# Altium schematic sheet Sensors.SchDoc
size A4; SheetNumber: 2; SheetTotal: 4
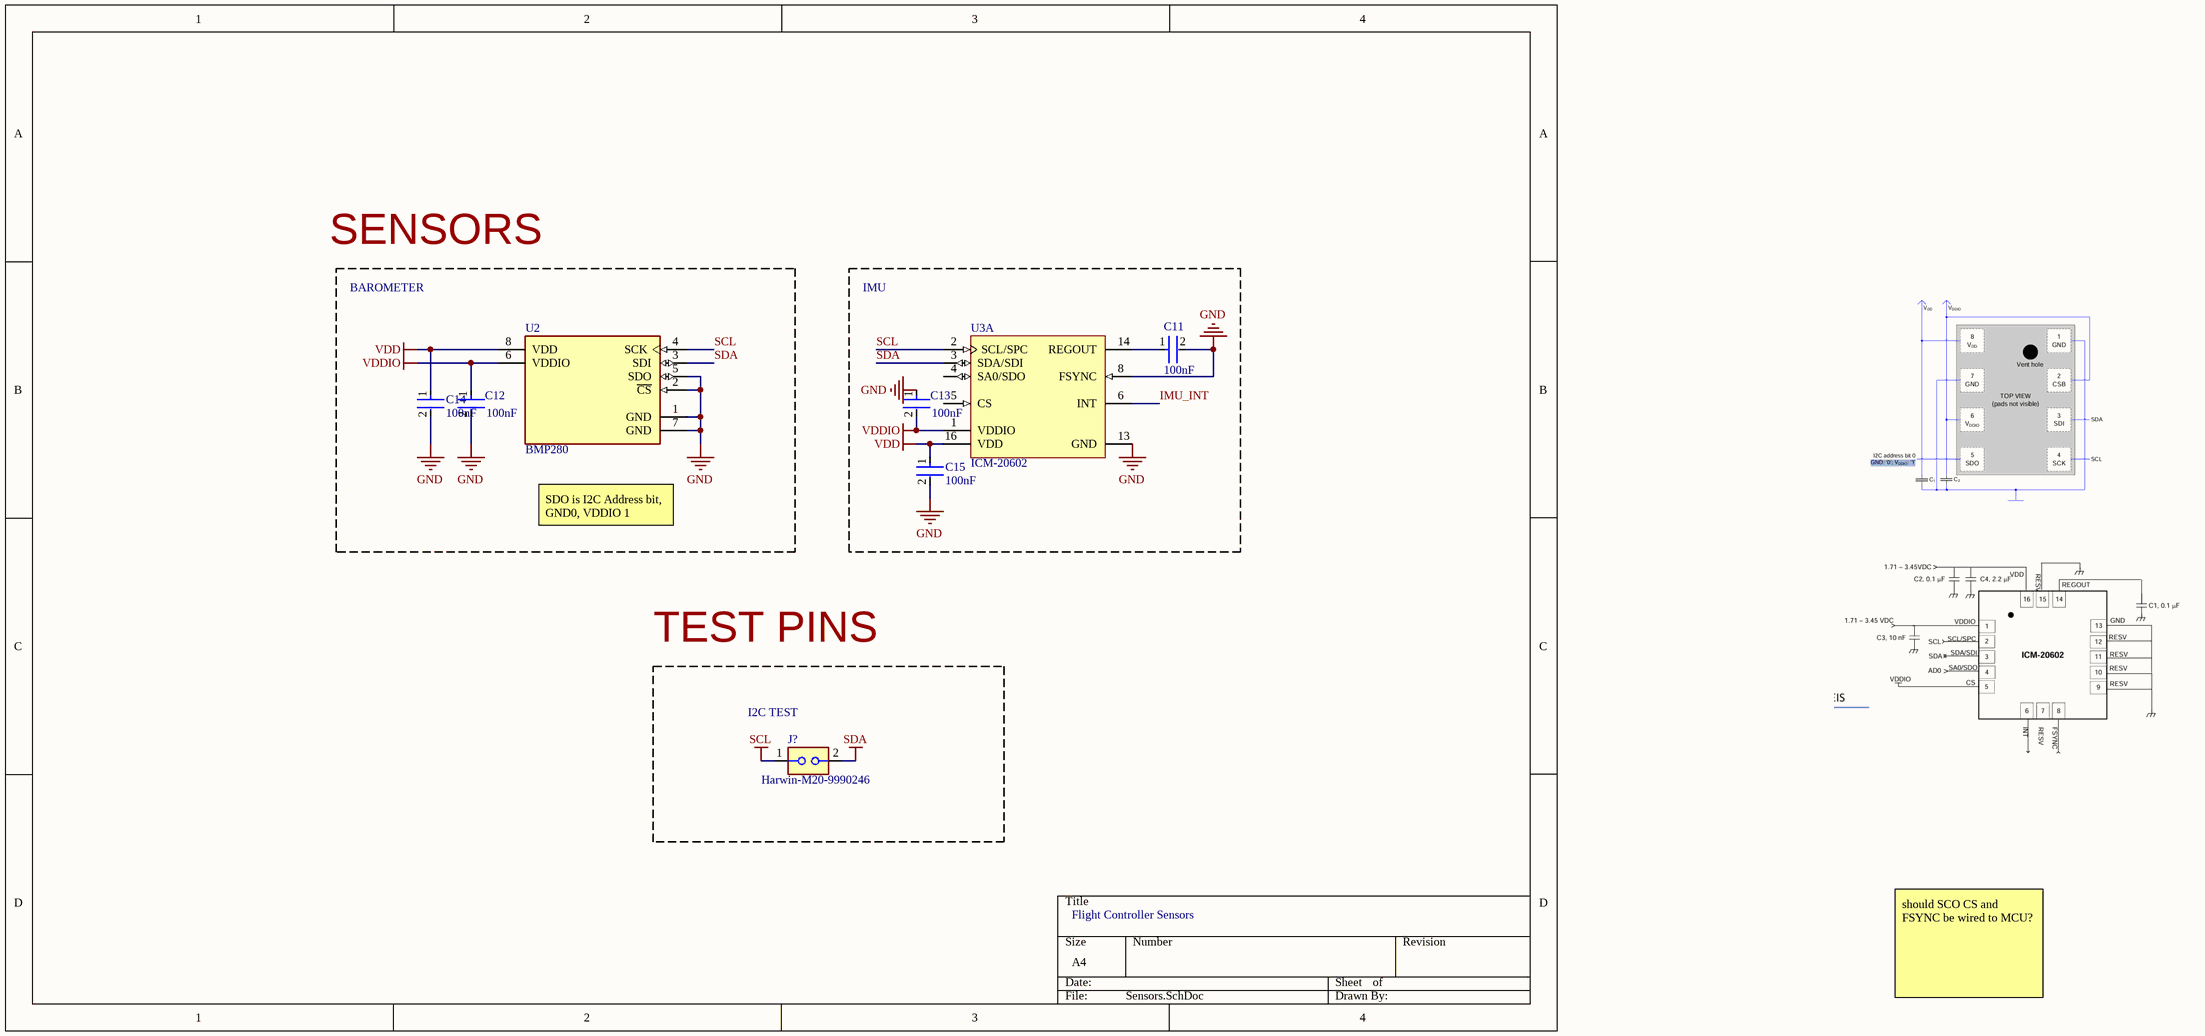
[diagram p0: Sensors.SchDoc]

## Parts
C11  100nF  [FP-CL93-IPC_C]
C12  100nF  [FP-CL93-IPC_C]
C13  100nF  [FP-CL93-IPC_C]
C14  100nF  [FP-CL93-IPC_C]
C15  100nF  [FP-CL93-IPC_C]
J?  Harwin-M20-9990246  [HARWIN_M20-9990246]
U2  BMP280  [FP-BMP280-MFG]
U3  ICM-20602  [INSE-I62-16]  (part A of 2)

## Blocks framed on the sheet
BAROMETER: C12 C14 U2
IMU: C11 C13 C15 U3
TEST PINS: J?

## Nets
GND: C11.2 C12.2 C13.1 C14.2 C15.2 U2.1(GND) U2.2(~{CS}) U2.5(SDO) U2.7(GND) U3.8(FSYNC) U3.13(GND)
SCL: J?.1 U2.4(SCK) U3.2(SCL/SPC)
SDA: J?.2 U2.3(SDI) U3.3(SDA/SDI)
VDD: C14.1 C15.1 U2.8(VDD) U3.16(VDD)
VDDIO: C12.1 C13.2 U2.6(VDDIO) U3.1(VDDIO)
IMU_INT: U3.6(INT)
NetC11_1: C11.1 U3.14(REGOUT)

Not connected (* = marked no-connect by the designer): U3 4(SA0/SDO) 5(CS)

## Notes on the sheet
- SENSORS
- SDO is I2C Address bit, GND0, VDDIO 1
- (near J?) I2C TEST
- Flight Controller Sensors
- should SCO CS and FSYNC be wired to MCU?

## Library data of the parts
C11-C15 = CMP-13271-000610-1: Cap Ceramic 100nF 10V X7R ±10% SMD 0402 +125°C Paper T/R
J? = CMP-00000-10: Connector Header Through Hole 2 position 0.100" (2.54mm); Number of Positions: 2; Contact Resistance: 30mR; Voltage Rating (AC): 750V; Max Current Rating: 3A; Insulation Resistance: 10GR; Gender: Male; Case/Package: SIL; Termination: Solder; Mount: Through Hole; Housing Material: Nylon; Max Operating Temperature: 105°C; JLCPCB Part No.: C3332353; Orientation: Straight; Contact Material: Bronze,Brass; Depth: 2.54mm; Current Rating: 3A; Radiation Hardening: No; Pitch: 2.54mm; Reach SVHC Compliant: No; Length: 5.08mm; Number of Rows: 1; Series: M20; Packaging: Bulk; Contact Plating: Tin; Contact Type: Male Pin; Color: Black; Contact Mating Length: 0.24inch; Package Quantity: 1000; Housing Color: Black; Min Operating Temperature: -40°C; Number of Contacts: 2
U2 = CMP-2000-05076-3: SENSOR PRESSURE ABS; Operating Pressure: 15.95PSI; Pressure Type: Absolute; Output Type: SPI; Max Pressure: 290.08PSI; Port Style: No Port; Case/Package: SMD/SMT; Lead Free: Lead Free; Termination: SMD/SMT; Min Operating Temperature: -40°C; Number of Pins: 8; Max Operating Temperature: 85°C
U3 = CMP-2000-07589-1: High Performance 6-Axis MEMS MotionTracking(TM) Device, 1.71 to 3.45 V, -40 to 85 degC, 16-Pin LGA, RoHS; Manufacturer: InvenSense; Sensor Type: Temperature; Output Type: I2C; RoHSCompliant: True; Datasheet Version: Rev. 1.0, 10/2016; Datasheet URL: http://www.invensense.com/wp-content/uploads/2016/10/DS-000176-ICM-20602-v1.0.pdf; Min Operating Temperature: -40degC; Mounting Technology: SurfaceMount; Max Operating Temperature: 85degC; Manufacturer URL: http://www.invensense.com/; Package Reference: I62-16; Package Description: 16-Pin Land Grid Array, Body 3 x 3 mm, Pitch 0.5 mm